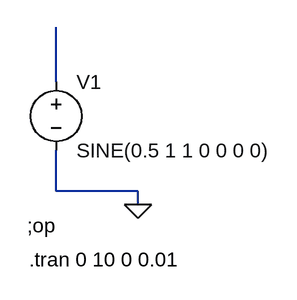
[diagram p0: schematic Transcient - mainspriegums.asc]
Transcient - mainspriegums.asc, the LTspice schematic file:
Version 4
SHEET 1 880 680
WIRE 176 48 176 -16
WIRE 176 176 176 128
WIRE 272 176 176 176
WIRE 272 192 272 176
FLAG 272 192 0
SYMBOL voltage 176 32 R0
WINDOW 123 0 0 Left 0
WINDOW 39 0 0 Left 0
SYMATTR InstName V1
SYMATTR Value SINE(0.5 1 1 0 0 0 0)
TEXT 142 216 Left 2 !;op
TEXT 144 256 Left 2 !.tran 0 10 0 0.01

The netlist it stands for:
* Transcient - mainspriegums.asc
V1 N001 0 SINE(0.5 1 1 0 0 0 0)
;op
.tran 0 10 0 0.01
.backanno
.end